# EAGLE schematic simple-ldr (EAGLE 8.5.2)
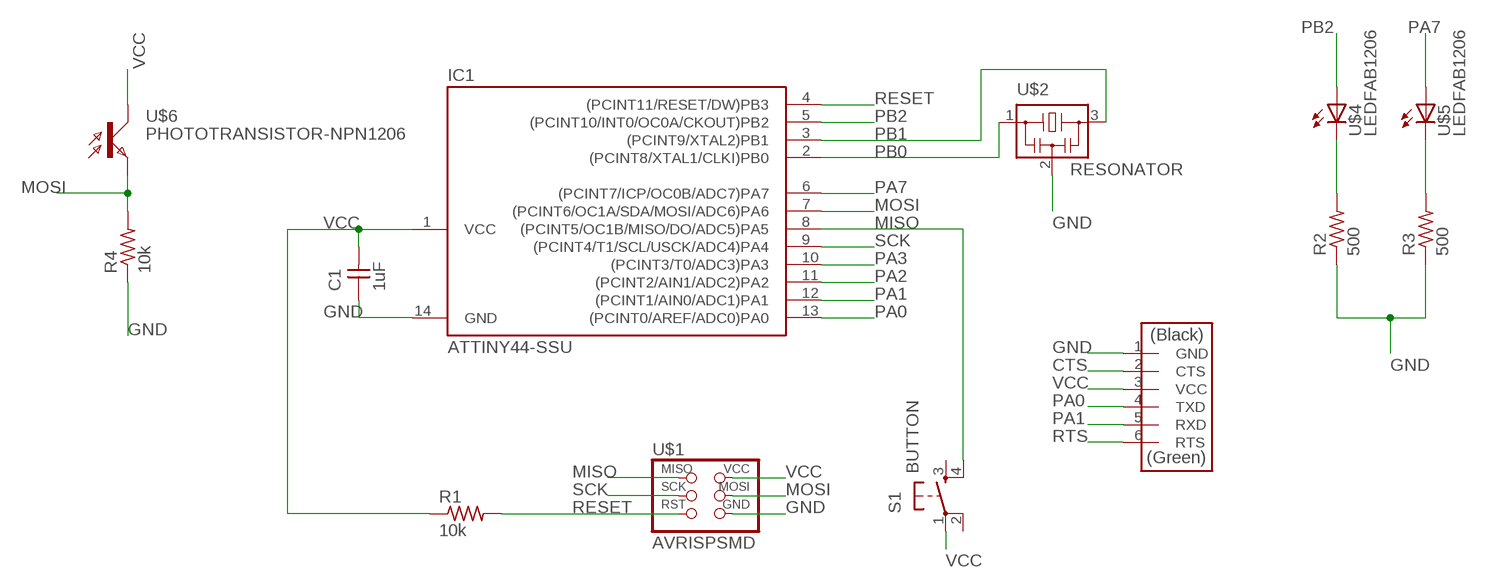
[diagram p0: schematic, sheet 1]

## Parts
C1  1uF  CAP-UNPOLARIZEDFAB  [C1206FAB]
IC1  ATTINY44-SSU  [SOIC14]
R1  10k  RES-US1206FAB  [R1206FAB]
R2  500  RES-US1206FAB  [R1206FAB]
R3  500  RES-US1206FAB  [R1206FAB]
R4  10k  RES-US1206FAB  [R1206FAB]
S1  BUTTON  6MM_SWITCH6MM_SWITCH  [6MM_SWITCH]
U$1  AVRISPSMD  [2X03SMD]
U$2  RESONATOR  [EFOBM]
U$3  FTDI-SMD-HEADER  [1X06SMD]
U$4  LEDFAB1206  [LED1206FAB]
U$5  LEDFAB1206  [LED1206FAB]
U$6  PHOTOTRANSISTOR-NPN1206  [OP1206]

## Nets
CTS: U$3.2(CTS)
GND: C1.1 IC1.14(GND) R2.1 R3.1 R4.1 U$1.6(GND) U$2.2 U$3.1(GND)
MISO: IC1.8((PCINT5/OC1B/MISO/DO/ADC5)PA5) S1.4(S1) U$1.1(MISO)
MOSI: IC1.7((PCINT6/OC1A/SDA/MOSI/ADC6)PA6) R4.2 U$1.4(MOSI) U$6.EMITTER(E)
N$1: R2.2 U$4.2(C)
N$2: R3.2 U$5.2(C)
PA0: IC1.13((PCINT0/AREF/ADC0)PA0) U$3.4(TXD)
PA1: IC1.12((PCINT1/AIN0/ADC1)PA1) U$3.5(RXD)
PA2: IC1.11((PCINT2/AIN1/ADC2)PA2)
PA3: IC1.10((PCINT3/T0/ADC3)PA3)
PA7: IC1.6((PCINT7/ICP/OC0B/ADC7)PA7) U$5.1(A)
PB0: IC1.2((PCINT8/XTAL1/CLKI)PB0) U$2.1
PB1: IC1.3((PCINT9/XTAL2)PB1) U$2.3
PB2: IC1.5((PCINT10/INT0/OC0A/CKOUT)PB2) U$4.1(A)
RESET: IC1.4((PCINT11/RESET/DW)PB3) R1.2 U$1.5(RST)
RTS: U$3.6(RTS)
SCK: IC1.9((PCINT4/T1/SCL/USCK/ADC4)PA4) U$1.3(SCK)
VCC: C1.2 IC1.1(VCC) R1.1 S1.1(P) U$1.2(VCC) U$3.3(VCC) U$6.COLLECTOR(C)
Unconnected: S1.2(P1) S1.3(S)

## Library data of the parts
C1 = fab:CAP-UNPOLARIZED
IC1 = fab:ATTINY44
R1-R4 = fab:RES-US: Resistor (US Symbol) Variants with postfix FAB are widened to allow the routing of internal traces
S1 = fab:6MM_SWITCH: OMRON SWITCH
U$1 = fab:AVRISP
U$2 = fab:RESONATOR
U$3 = fab:FTDI-SMD-HEADER
U$4 U$5 = fab:LED: LED
U$6 = fab:PHOTOTRANSISTOR-NPN